# EAGLE schematic Interfaz Motor Maxon (EAGLE 9.6.2)
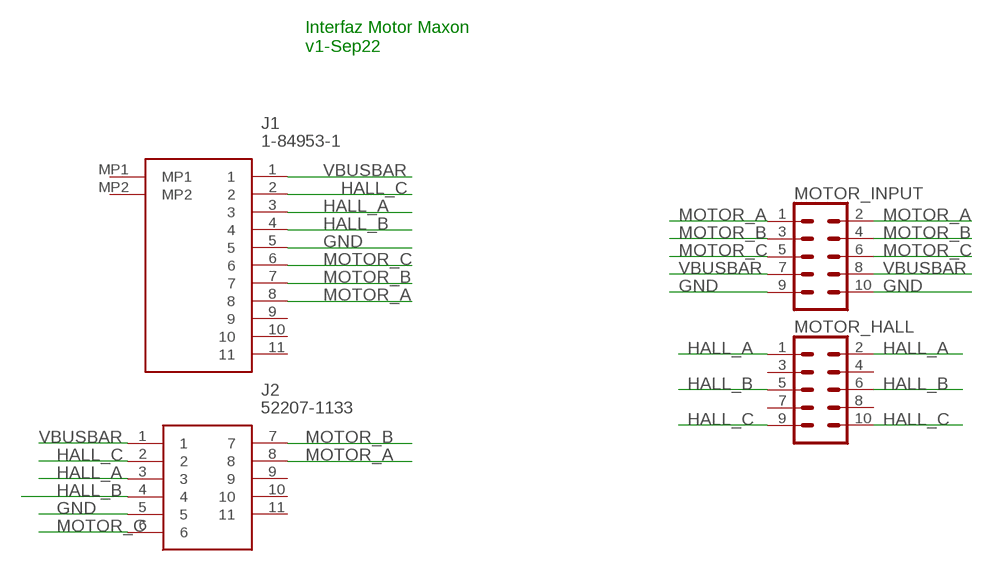
[diagram p0: schematic, sheet 1]

## Parts
J1  1-84953-1  [1849531]
J2  52207-1133  [52207-1133]
MOTOR_HALL  CONN_05X2PTH  [2X5]
MOTOR_INPUT  CONN_05X2PTH  [2X5]

## Nets
GND: J1.5 J2.5 MOTOR_INPUT.9 MOTOR_INPUT.10
HALL_A: J1.3 J2.3 MOTOR_HALL.1 MOTOR_HALL.2
HALL_B: J1.4 J2.4 MOTOR_HALL.5 MOTOR_HALL.6
HALL_C: J1.2 J2.2 MOTOR_HALL.9 MOTOR_HALL.10
MOTOR_A: J1.8 J2.8 MOTOR_INPUT.1 MOTOR_INPUT.2
MOTOR_B: J1.7 J2.7 MOTOR_INPUT.3 MOTOR_INPUT.4
MOTOR_C: J1.6 J2.6 MOTOR_INPUT.5 MOTOR_INPUT.6
VBUSBAR: J1.1 J2.1 MOTOR_INPUT.7 MOTOR_INPUT.8
Unconnected: J1.9 J1.10 J1.11 J1.MP1 J1.MP2 J2.9 J2.10 J2.11 MOTOR_HALL.3 MOTOR_HALL.4 MOTOR_HALL.7 MOTOR_HALL.8

## Notes on the sheet
- Interfaz Motor Maxon
  v1-Sep22

## Library data of the parts
J1 = 1-84953-1:1-84953-1: 1MM FPC HORZ.TOP CONT.ASSY 11P Source: Datasheet <https://www.te.com/commerce/DocumentDelivery/DDEController?Action=showdoc&DocId=Customer Drawing84953A3pdfEnglishENG_CD_84953_A3.pdf1-84953-5>; ARROW_PART_NUMBER: 1-84953-1; ARROW_PRICE-STOCK: https://www.arrow.com/en/products/1-84953-1/te-connectivity?region=nac; DESCRIPTION: 1MM FPC HORZ.TOP CONT.ASSY 11P; HEIGHT: 2.74mm; MANUFACTURER_NAME: TE Connectivity; MANUFACTURER_PART_NUMBER: 1-84953-1; MOUSER_PART_NUMBER: 571-1-84953-1; MOUSER_PRICE-STOCK: https://www.mouser.co.uk/ProductDetail/TE-Connectivity/1-84953-1?qs=uUkeXfjQ8uQbyHjuXR99Yw%3D%3D
J2 = 52207-1133:52207-1133: FFC & FPC Connectors 1.0 FPC ZIF 11Ckt Sn-Ag-Bi Source: Datasheet <http://www.molex.com/pdm_docs/sd/522072033_sd.pdf>; DESCRIPTION: FFC & FPC Connectors 1.0 FPC ZIF 11Ckt Sn-Ag-Bi; HEIGHT: mm; MANUFACTURER_NAME: Molex; MANUFACTURER_PART_NUMBER: 52207-1133; MOUSER_PART_NUMBER: 538-52207-1133; MOUSER_PRICE-STOCK: https://www.mouser.co.uk/ProductDetail/Molex/52207-1133?qs=rw2VfpiI%2FsMfVoKouvnHSg%3D%3D
MOTOR_HALL MOTOR_INPUT = SparkFun-Connectors:CONN_05X2: Multi connection point. Often used as Generic Header-pin footprint for 0.1 inch spaced/style header connections For AVR SPI programming port, see special device with nice symbol: "AVR_SPI_PROG_5x2.dev" You can populate with any combo of single row headers, but if you'd like an exact match, check these: 2x5 AVR ICSP Male Header <https://www.sparkfun.com/products/778> (PRT-00778) 2x5 Pin Shrouded Header <https://www.sparkfun.com/products/8506> (PRT-08506) On any of the 0.1 inch spaced packages, you can populate with these: Break Away Headers - Straight <https://www.sparkfun.com/products/116> (PRT-00116) Break Away Male Headers - Right Angle <https://www.sparkfun.com/products/553> (PRT-00553) Female Headers <https://www.sparkfun.com/products/115> (PRT-00115) Break Away Headers - Machine Pin <https://www.sparkfun.com/products/117> (PRT-00117) Break Away Female Headers - Swiss Machine Pin <https://www.sparkfun.com/products/743> (PRT-00743) Special note: the shrouded connector mates well with our 5x2 ribbon cables: 2x5 Pin IDC Ribbon Cable <https://www.sparkfun.com/products/8535> (PRT-08535); PROD_ID: CONN-08499; SF_ID: PRT-0778